# EasyEDA schematic SCH_hdzero analog module slim_2023-08-07.json
TITLE: Sheet_1; REV: 1.0; Date: 2023-08-03; Sheet: 1/1; Company: Your Company
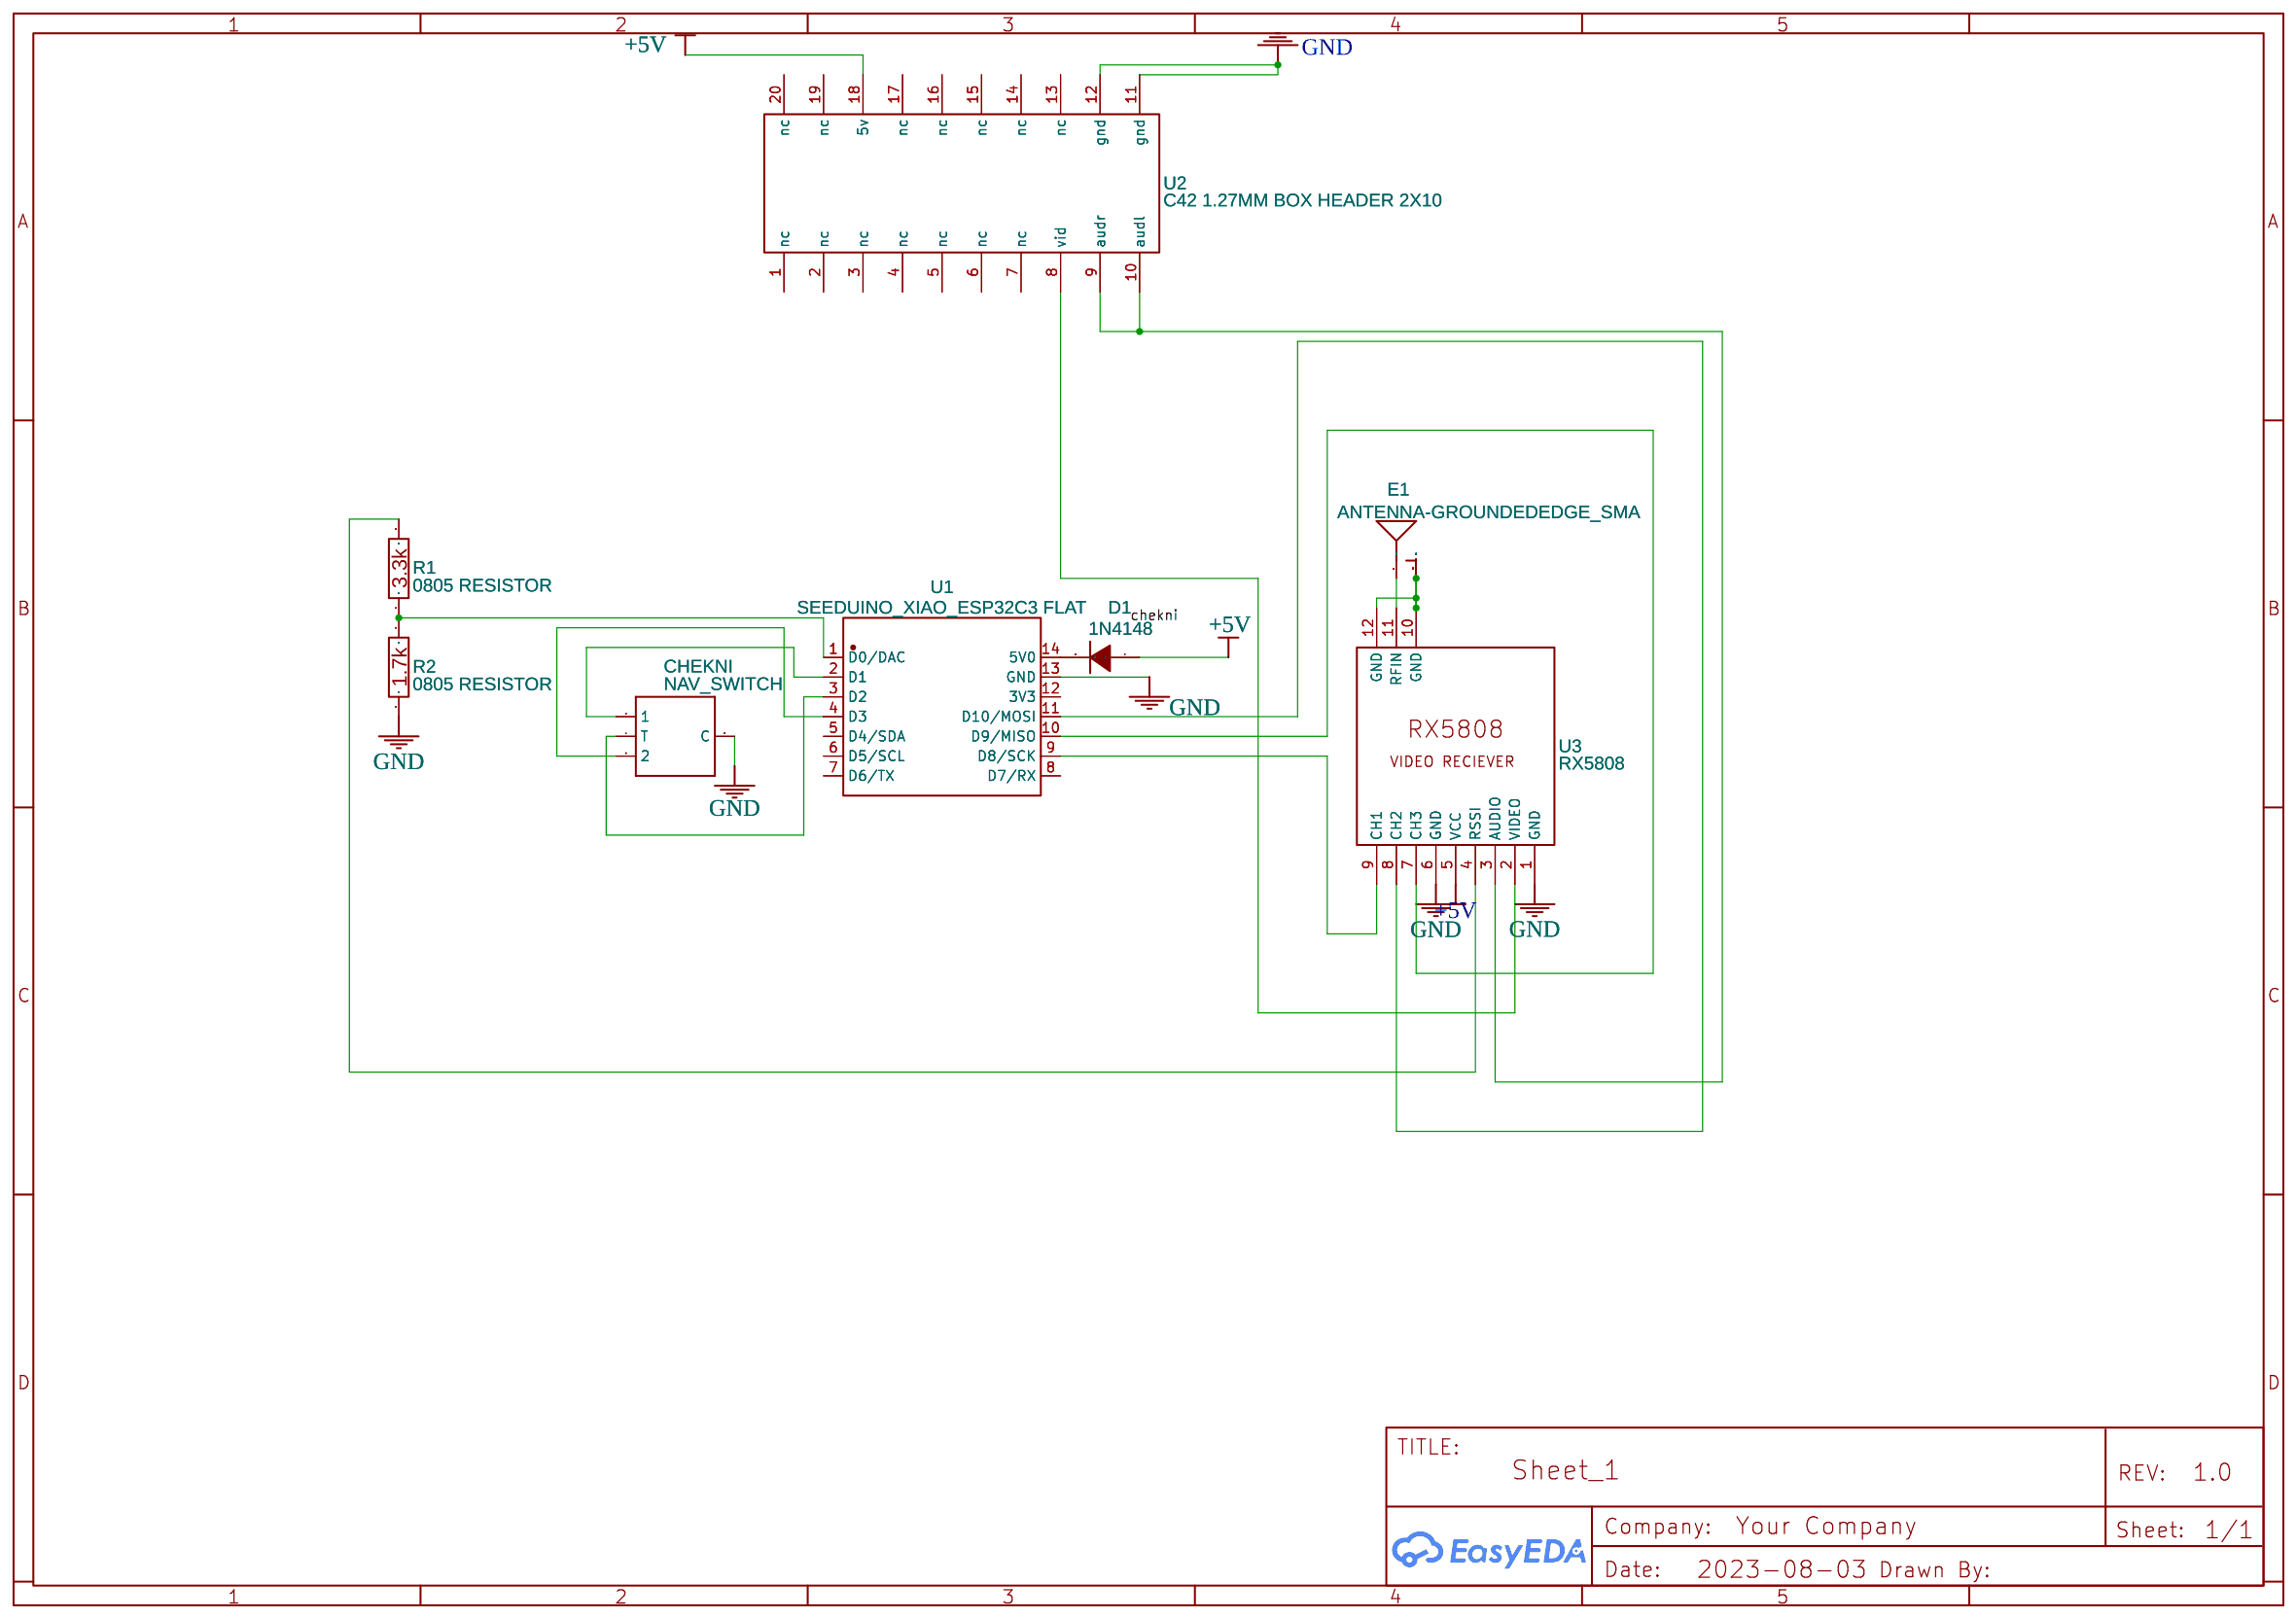
[diagram p0: schematic sheet]

## Parts
CHEKNI  NAV_SWITCH  [NAV_SWITCH]
D1  1N4148  [DO-35_BD2.0-L4.0-P8.00-D0.5-FD]
E1  ANTENNA-GROUNDEDEDGE_SMA  [SMA-EDGE]
R1  0805 RESISTOR  [0805 RESISTOR]
R2  0805 RESISTOR  [0805 RESISTOR]
U1  SEEDUINO_XIAO_ESP32C3 FLAT  [SEEDUINO_XIAO_ESP32C3]
U2  C42 1.27MM BOX HEADER 2X10  [HEADER2X10-1.27X1.27]
U3  RX5808  [RX5808]

## Library data of the parts
CHEKNI = NAV_SWITCH: Contributor: SparkFun
D1 = 1N4148: Supplier: LCSC; Manufacturer: ST(先科); Supplier Part: C14516; JLCPCB Part Class: Extended Part
E1 = ANTENNA-GROUNDEDEDGE_RPSMA: Contributor: sushilk1402
R1 R2 = 0805 RESISTOR: Contributor: rhalfcaacbay
U1 = SEEDUINO_XIAO_ESP32C3 FLAT: Contributor: anandj
U2 = C42 1.27MM BOX HEADER 2X10: Manufacturer Part: New SchematicLib; Contributor: martin
U3 = RX5808: Contributor: andriu-ru

## Nets
+5V: D1.1(A) U2.18(5v) U3.5(VCC)
GND: CHEKNI.C R2.1 U1.13(GND) U2.11(gnd) U2.12(gnd) U3.1(GND) U3.6(GND)
Net-(CHEKNI-1): CHEKNI.1 U1.2(D1)
Net-(CHEKNI-2): CHEKNI.2 U1.4(D3)
Net-(CHEKNI-T): CHEKNI.T U1.3(D2)
Net-(D1-2): D1.2(C) U1.14(5V0)
Net-(E1-GND@0): E1.GND@0(GND) E1.GND@1(GND) E1.GND@2(GND) E1.GND@3(GND) U3.10(GND) U3.12(GND)
Net-(E1-SIG): E1.SIG(SIGNAL) U3.11(RFIN)
Net-(R1-1): R1.1 R2.2 U1.1(D0/DAC)
Net-(R1-2): R1.2 U3.4(RSSI)
Net-(U1-9): U1.9(D8/SCK) U3.9(CH1)
Net-(U1-10): U1.10(D9/MISO) U3.7(CH3)
Net-(U1-11): U1.11(D10/MOSI) U3.8(CH2)
Net-(U2-8): U2.8(vid) U3.2(VIDEO)
Net-(U2-9): U2.9(audr) U2.10(audl) U3.3(AUDIO)

Not connected (* = marked no-connect by the designer): U1 5(D4/SDA) 6(D5/SCL) 7(D6/TX) 8(D7/RX) 12(3V3); U2 1(nc) 2(nc) 3(nc) 4(nc) 5(nc) 6(nc) 7(nc) 13(nc) 14(nc) 15(nc) 16(nc) 17(nc) 19(nc) 20(nc)
